# Altium schematic sheet LinkLite.SchDoc
size 381 x 241 mm
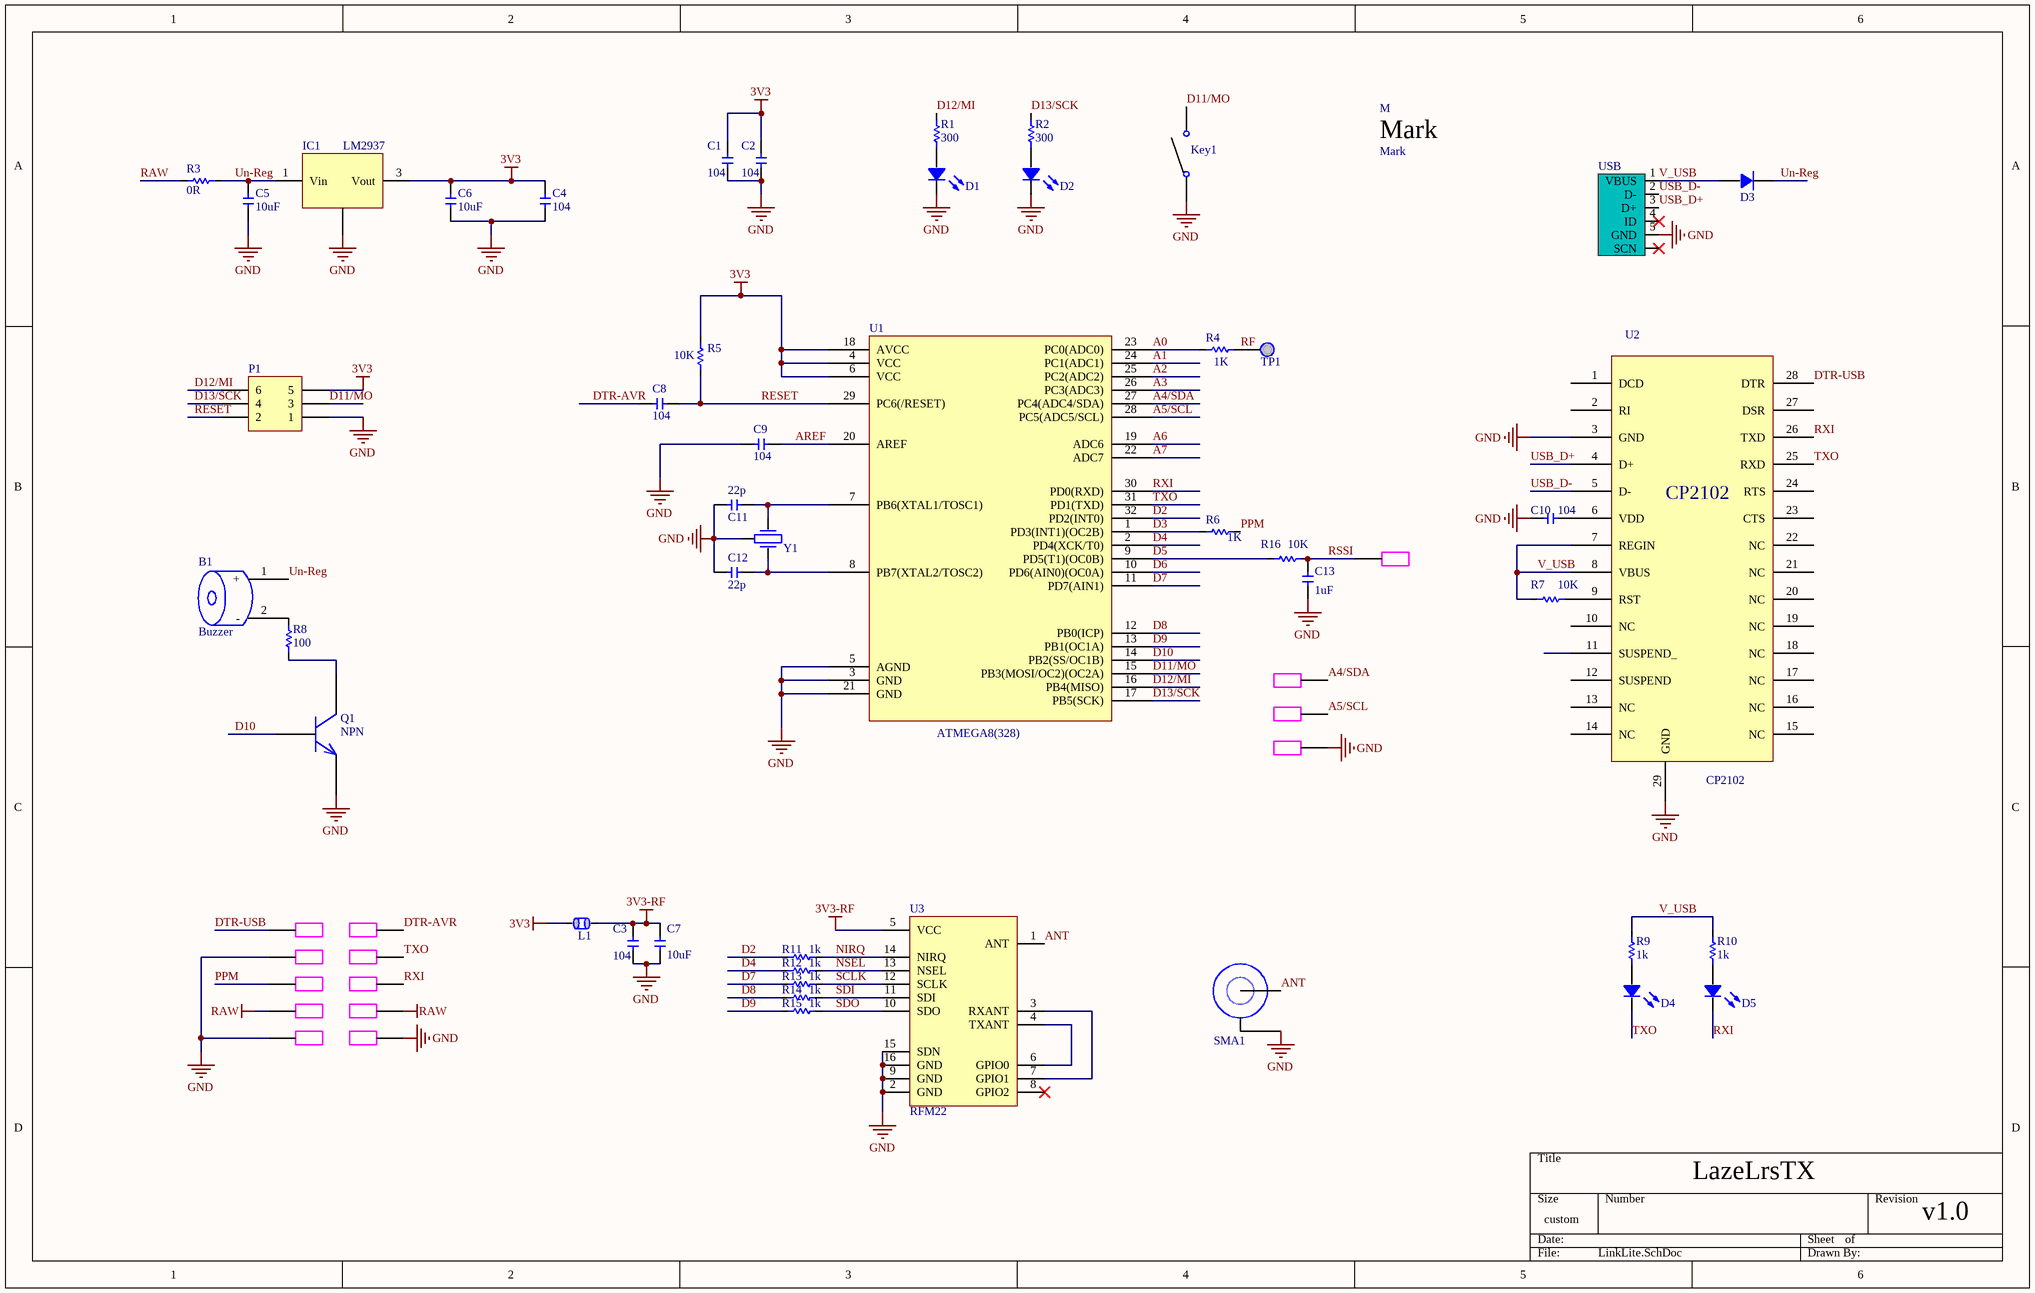
[diagram p0: LinkLite.SchDoc]

## Parts
B1  Buzzer  [BUZZER9055]
C1  104  [0603 CAP]
C2  104  [0603 CAP]
C3  104  [0603 CAP]
C4  104  [0603 CAP]
C5  10uF  [1206]
C6  10uF  [1206]
C7  10uF  [1206]
C8  104  [0603 CAP]
C9  104  [0603 CAP]
C10  104  [0603 CAP]
C11  22p  [0603 CAP]
C12  22p  [0603 CAP]
C13  1uF  [0603 CAP]
D1  LED  [0805 LED]  (value not drawn)
D2  LED  [0805 LED]  (value not drawn)
D3  Diode  [DIODE-SOD123]  (value not drawn)
D4  LED  [0603 cap]  (value not drawn)
D5  LED  [0603 cap]  (value not drawn)
IC1  LM2937  [LM2937]
Key1  Key666  [KEY 666]  (value not drawn)
L1  FB 300mA  [0603 IND]  (value not drawn)
M  Mark  [MarkPoint]
P1  Header 3X2  [HDR2X3]  (value not drawn)
Pad1  EdgePad  [edgepad]  (value not drawn)
Pad2  EdgePad  [edgepad]  (value not drawn)
Pad3  EdgePad  [edgepad]  (value not drawn)
Pad4  EdgePad  [edgepad]  (value not drawn)
Pad5  EdgePad  [edgepad]  (value not drawn)
Pad6  EdgePad  [edgepad]  (value not drawn)
Pad7  EdgePad  [edgepad]  (value not drawn)
Pad8  EdgePad  [edgepad]  (value not drawn)
Pad9  EdgePad  [edgepad]  (value not drawn)
Pad10  EdgePad  [edgepad]  (value not drawn)
Pad11  EdgePad  [edgepad]  (value not drawn)
Pad12  EdgePad  [edgepad]  (value not drawn)
Pad13  EdgePad  [edgepad]  (value not drawn)
Pad14  EdgePad  [edgepad]  (value not drawn)
Q1  NPN  [NPN-SOT-23B_M]
R1  300  [0603 RES]
R2  300  [0603 RES]
R3  0R  [0603 RES]
R4  1K  [0603 RES]
R5  10K  [0603 RES]
R6  1K  [0603 RES]
R7  10K  [0603 RES]
R8  100  [0603 RES]
R9  1k  [0603 RES]
R10  1k  [0603 RES]
R11  1k  [0603 RES]
R12  1k  [0603 RES]
R13  1k  [0603 RES]
R14  1k  [0603 RES]
R15  1k  [0603 RES]
R16  10K  [0603 RES]
SMA1  SMA Base  [ANT SMA]  (value not drawn)
TP1  Test Pad  [Test Pad 1.2MM]  (value not drawn)
U1  ATmega328  [ATMEGA328FIX]  (value not drawn)
U2  CP2102  [CP2102]
U3  RFM22  [RFM22SMD]
USB  USB  [MINI USB A]  (value not drawn)
Y1  Crystal3Foot  [Crystal3Foot]  (value not drawn)

## Nets
3V3: C1.1 C2.1 C4.1 C6.2 IC1.3(Vout) L1.1 P1.5 R5.2 U1.4(VCC) U1.6(VCC) U1.18(AVCC)
3V3-RF: C3.1 C7.1 L1.2 U3.5(VCC)
GND: C1.2 C2.2 C3.2 C4.2 C5.1 C6.1 C7.2 C9.2 C10.1 C11.1 C12.1 C13.1 D1.2(K) D2.2(K) IC1.2(Gnd) Key1.1 P1.1 Pad3.1 Pad9.1 Pad12.1 Pad14.1 Q1.2(Gnd) SMA1.2(Gnd) U1.3(GND) U1.5(AGND) U1.21(GND) U2.3(GND) U2.29(GND) U3.2(GND) U3.9(GND) U3.15(SDN) U3.16(GND) USB.5(GND) Y1.2
RAW: Pad7.1 Pad8.1 R3.2
A0: R4.2 U1.23(PC0(ADC0))
A1: U1.24(PC1(ADC1))
A2: U1.25(PC2(ADC2))
A3: U1.26(PC3(ADC3))
A4/SDA: Pad10.1 U1.27(PC4(ADC4/SDA))
A5/SCL: Pad11.1 U1.28(PC5(ADC5/SCL))
A6: U1.19(ADC6)
A7: U1.22(ADC7)
ANT: SMA1.1(Ant) U3.1(ANT)
AREF: C9.1 U1.20(AREF)
D2: R11.2 U1.32(PD2(INT0))
D3: R6.2 U1.1(PD3(INT1)(OC2B))
D4: R12.2 U1.2(PD4(XCK/T0))
D5: R16.2 U1.9(PD5(T1)(OC0B))
D6: U1.10(PD6(AIN0)(OC0A))
D7: R13.2 U1.11(PD7(AIN1))
D8: R14.2 U1.12(PB0(ICP))
D9: R15.2 U1.13(PB1(OC1A))
D10: Q1.1(Sig) U1.14(PB2(SS/OC1B))
D11/MO: Key1.2 P1.3 U1.15(PB3(MOSI/OC2)(OC2A))
D12/MI: P1.6 R1.1 U1.16(PB4(MISO))
D13/SCK: P1.4 R2.1 U1.17(PB5(SCK))
DTR-AVR: C8.2 Pad2.1
DTR-USB: Pad1.1 U2.28(DTR)
NIRQ: R11.1 U3.14(NIRQ)
NSEL: R12.1 U3.13(NSEL)
PPM: Pad5.1 R6.1
RESET: C8.1 P1.2 R5.1 U1.29(PC6(/RESET))
RF: R4.1 TP1.1
RSSI: C13.2 Pad13.1 R16.1
RXI: D5.2(K) Pad6.1 U1.30(PD0(RXD)) U2.26(TXD)
SCLK: R13.1 U3.12(SCLK)
SDI: R14.1 U3.11(SDI)
SDO: R15.1 U3.10(SDO)
TXO: D4.2(K) Pad4.1 U1.31(PD1(TXD)) U2.25(RXD)
Un-Reg: B1.1(+) C5.2 D3.2(B) IC1.1(Vin) R3.1
USB_D+: U2.4(D+) USB.3(D+)
USB_D-: U2.5(D-) USB.2(D-)
V_USB: D3.1(A) R7.2 R9.1 R10.1 U2.7(REGIN) U2.8(VBUS) USB.1(VBUS)
NetB1_2: B1.2(-) R8.1
NetC10_2: C10.2 U2.6(VDD)
NetC11_2: C11.2 U1.7(PB6(XTAL1/TOSC1)) Y1.1
NetC12_2: C12.2 U1.8(PB7(XTAL2/TOSC2)) Y1.3
NetD1_1: D1.1(A) R1.2
NetD2_1: D2.1(A) R2.2
NetD4_1: D4.1(A) R9.2
NetD5_1: D5.1(A) R10.2
NetQ1_3: Q1.3(Collector) R8.2
NetR7_1: R7.1 U2.9(RST)
NetU3_3: U3.3(RXANT) U3.7(GPIO1)
NetU3_4: U3.4(TXANT) U3.6(GPIO0)

Not connected (* = marked no-connect by the designer): U2 1(DCD) 2(RI) 10(NC) 11(SUSPEND_) 12(SUSPEND) 13(NC) 14(NC) 15(NC) 16(NC) 17(NC) 18(NC) 19(NC) 20(NC) 21(NC) 22(NC) 23(CTS) 24(RTS) 27(DSR); U3 8(GPIO2)*; USB 0(SCN)* 4(ID)*

## Notes on the sheet
- LazeLrsTX
- v1.0
- (in symbol ATmega328) ATMEGA8(328)

## Library data of the parts
C1-C13 = CAP: Capacitor; Value: 100nF; Published: 8-Jun-2000; Revision: July-2002: Re-released for DXP Platform.; Publisher: Altium Limited
D1 D2 D4 D5 = LED: Typical RED, GREEN, YELLOW, AMBER GaAs LED; Published: 8-Jun-2000; LatestRevisionDate: 17-Jul-2002; LatestRevisionNote: Re-released for DXP Platform.; PackageDocument: Feb-2002; PackageReference: 3.2X1.6X1.1; Publisher: Altium Limited
L1 = FerriteBead_300mA: Ferrite Bead 300mA; Manufacturer: Generic Components; Class: Passive; Supplier 1: Digi-Key; Supplier Part Number 1: 732-1586-1-ND
P1 = Header 3X2: Header, 3-Pin, Dual row; LatestRevisionDate: 17-Jul-2002; LatestRevisionNote: Re-released for DXP Platform.; Publisher: Altium Limited
R1-R16 = Res: Resistor; Published: 8-Jun-2000; Revision: July-2002: Re-released for DXP Platform.; Publisher: Altium Limited
USB = USB_SMT_B: USB Type-B SMT Socket; Class: Connector; Supplier 1: Digi-Key; Supplier Part Number 1: 670-1190-1-ND